# Altium schematic sheet PAGE15 FLASH.SchDoc
size A4
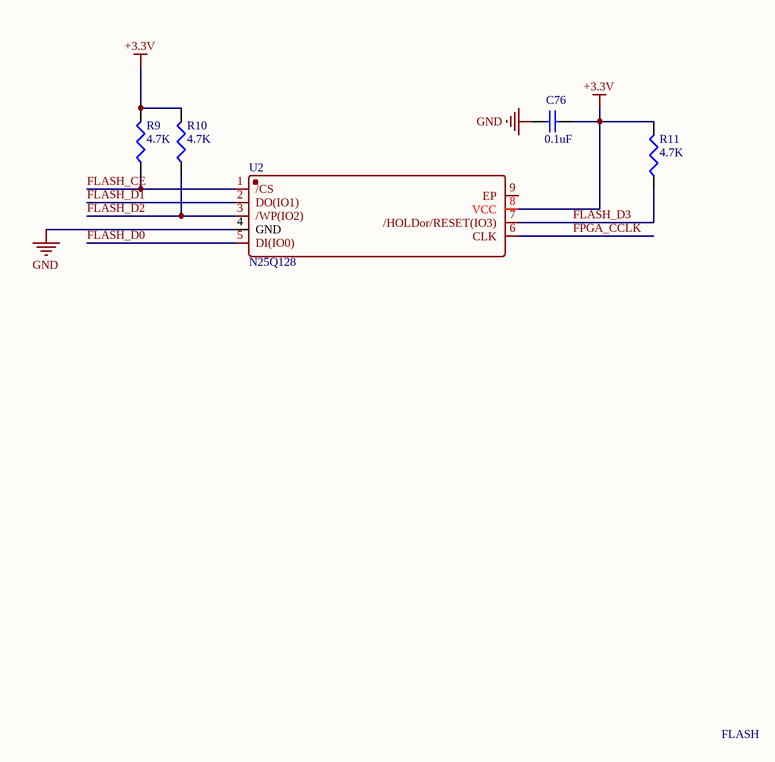
[diagram p0: PAGE15 FLASH.SchDoc]

## Parts
C76  value 0.1uF  [0402]  (hidden comment: Cap Semi)
R9  value 4.7K  [J1-0603]  (hidden comment: Res3)
R10  value 4.7K  [J1-0603]  (hidden comment: Res3)
R11  value 4.7K  [J1-0603]  (hidden comment: Res3)
U2  N25Q128  [WSON-8_L6.0-W8.0-P1.27-BL-EP]

## Nets
+3.3V: C76.2 R9.2 R10.2 R11.2 U2.8(VCC)
GND: C76.1 U2.4(GND)
FLASH_CE: R9.1 U2.1(/CS)
FLASH_D0: U2.5(DI(IO0))
FLASH_D1: U2.2(DO(IO1))
FLASH_D2: R10.1 U2.3(/WP(IO2))
FLASH_D3: R11.1 U2.7(/HOLDor/RESET(IO3))
FPGA_CCLK: U2.6(CLK)

Not connected (* = marked no-connect by the designer): U2 9(EP)

## Notes on the sheet
- FLASH

## Library data of the parts
C76 = Cap Semi: Capacitor (Semiconductor SIM Model); Published: 8-Jun-2000; LatestRevisionDate: 29-May-2009; LatestRevisionNote: IPC-7351 Footprint Added.; PackageReference: C1206; Publisher: Altium Limited; PackageDescription: Chip Capacitor
R9-R11 = Res3: Resistor; Published: 8-Jun-2000; LatestRevisionDate: 29-May-2009; LatestRevisionNote: IPC-7351 Footprint Added.; PackageReference: J1-0603; Publisher: Altium Limited; PackageDescription: Chip Resistor